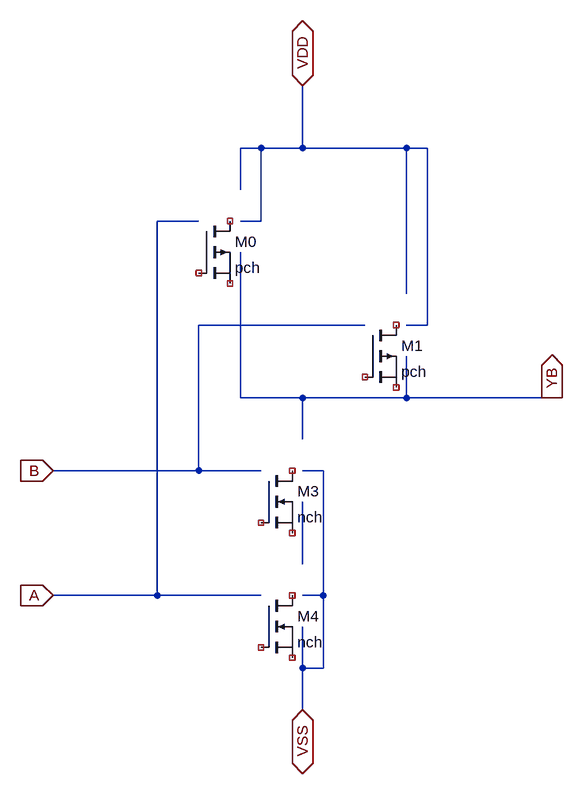
[diagram p0: schematic na21.asc]
na21.asc, the LTspice schematic file:
Version 4
SHEET 1 944 1152
WIRE 480 96 480 192
WIRE 480 192 640 192
WIRE 640 192 672 192
WIRE 672 464 672 192
WIRE 640 464 672 464
WIRE 640 416 640 192
WIRE 416 192 480 192
WIRE 384 256 384 192
WIRE 384 192 416 192
WIRE 416 304 416 192
WIRE 384 304 416 304
WIRE 480 832 480 736
WIRE 640 576 864 576
WIRE 864 576 880 576
WIRE 480 640 480 576
WIRE 480 576 640 576
WIRE 384 576 384 352
WIRE 384 576 480 576
WIRE 640 576 640 512
WIRE 256 880 256 304
WIRE 256 880 416 880
WIRE 256 304 320 304
WIRE 96 880 256 880
WIRE 512 880 512 688
WIRE 480 1056 480 992
WIRE 480 992 480 928
WIRE 480 992 512 992
WIRE 512 992 512 880
WIRE 480 688 512 688
WIRE 480 880 512 880
WIRE 320 688 320 464
WIRE 320 688 416 688
WIRE 320 464 576 464
WIRE 96 688 320 688
SYMBOL NMOS 416 880 R0
SYMATTR InstName M4
SYMATTR Value nch
SYMATTR Value2 w=2u l=1u
SYMBOL NMOS 416 688 R0
SYMATTR InstName M3
SYMATTR Value nch
SYMATTR Value2 w=2u l=1u
SYMBOL PMOS 576 464 R0
SYMATTR InstName M1
SYMATTR Value pch
SYMATTR Value2 w=6u l=1u
SYMBOL PMOS 320 304 R0
SYMATTR InstName M0
SYMATTR Value pch
SYMATTR Value2 w=6u l=1u
FLAG 864 576 YB
IOPIN 864 576 Out
FLAG 480 1056 VSS
IOPIN 480 1056 BiDir
FLAG 480 96 VDD
IOPIN 480 96 BiDir
FLAG 96 688 B
IOPIN 96 688 In
FLAG 96 880 A
IOPIN 96 880 In

The netlist it stands for:
* na21.asc
* M4: nch w=2u l=1u (symbol NMOS not certain, pin order unknown); nets seen at it: 
* M3: nch w=2u l=1u (symbol NMOS not certain, pin order unknown); nets seen at it: 
* M1: pch w=6u l=1u (symbol PMOS not certain, pin order unknown); nets seen at it: 
* M0: pch w=6u l=1u (symbol PMOS not certain, pin order unknown); nets seen at it: 
.backanno
.end